# EAGLE design 5ButtonSwitch.ItsyBitsyM0.Rev1.0 (EAGLE 8.6.0)
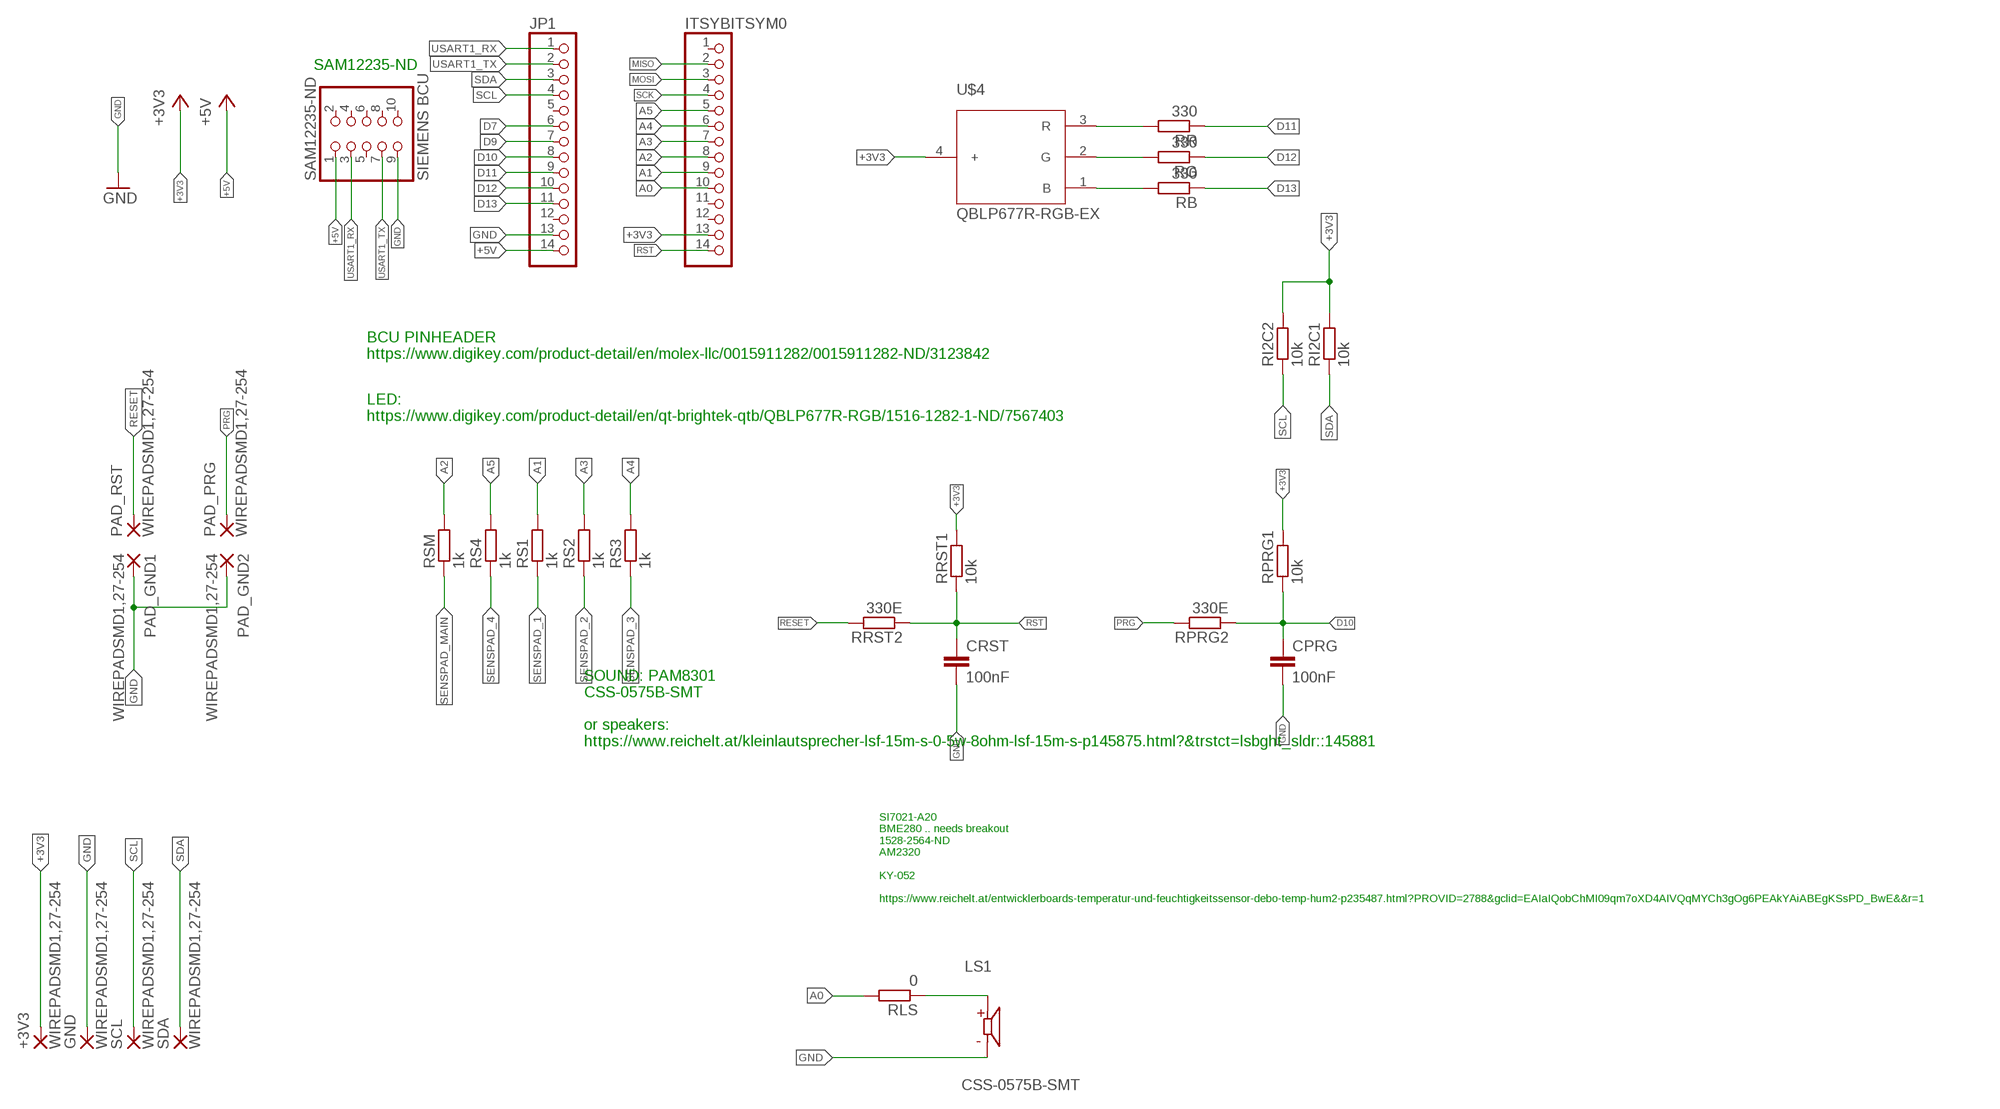
[diagram p0: schematic, sheet 1]

## Parts
+3V3  WIREPADSMD1,27-254  [SMD1,27-2,54]
CPRG  100nF  C-EUC1206  [C1206]
CRST  100nF  C-EUC1206  [C1206]
GND  WIREPADSMD1,27-254  [SMD1,27-2,54]
ITSYBITSYM0  PINHD-1X141X14_SMT  [1X14_SMT]
JP1  PINHD-1X141X14_SMT  [1X14_SMT]
LS1  CSS-0575B-SMT  [CUI_CSS-0575B-SMT]
PAD_GND1  WIREPADSMD1,27-254  [SMD1,27-2,54]
PAD_GND2  WIREPADSMD1,27-254  [SMD1,27-2,54]
PAD_PRG  WIREPADSMD1,27-254  [SMD1,27-2,54]
PAD_RST  WIREPADSMD1,27-254  [SMD1,27-2,54]
RB  330  R-EU_R1206  [R1206]
RG  330  R-EU_R1206  [R1206]
RI2C1  10k  R-EU_R1206  [R1206]
RI2C2  10k  R-EU_R1206  [R1206]
RLS  0  R-EU_R1206  [R1206]
RPRG1  10k  R-EU_R1206  [R1206]
RPRG2  330E  R-EU_R1206  [R1206]
RR  330  R-EU_R1206  [R1206]
RRST1  10k  R-EU_R1206  [R1206]
RRST2  330E  R-EU_R1206  [R1206]
RS1  1k  R-EU_R1206  [R1206]
RS2  1k  R-EU_R1206  [R1206]
RS3  1k  R-EU_R1206  [R1206]
RS4  1k  R-EU_R1206  [R1206]
RSM  1k  R-EU_R1206  [R1206]
SAM12235-ND  SIEMENS BCU  PINHD-2X5_2.54-SMD  [2X05SMD]
SCL  WIREPADSMD1,27-254  [SMD1,27-2,54]
SDA  WIREPADSMD1,27-254  [SMD1,27-2,54]
U$4  QBLP677R-RGB-EX  [PLCC4R_EX]

## Nets
+3V3: +3V3.1(P) ITSYBITSYM0.13 RI2C1.2 RI2C2.2 RPRG1.2 RRST1.2 U$4.4(+)
+5V: JP1.14 SAM12235-ND.1
A0: ITSYBITSYM0.10 RLS.2
A1: ITSYBITSYM0.9 RS1.2
A2: ITSYBITSYM0.8 RSM.2
A3: ITSYBITSYM0.7 RS2.2
A4: ITSYBITSYM0.6 RS3.2
A5: ITSYBITSYM0.5 RS4.2
D7: JP1.6
D9: JP1.7
D10: CPRG.1 JP1.8 RPRG1.1 RPRG2.1
D11: JP1.9 RR.1
D12: JP1.10 RG.1
D13: JP1.11 RB.1
GND: CPRG.2 CRST.2 GND.1(P) JP1.13 LS1.2(N) PAD_GND1.1(P) PAD_GND2.1(P) SAM12235-ND.9
MISO: ITSYBITSYM0.2
MOSI: ITSYBITSYM0.3
N$1: RB.2 U$4.1(B)
N$2: RG.2 U$4.2(G)
N$3: RR.2 U$4.3(R)
N$4: LS1.1(P) RLS.1
PRG: PAD_PRG.1(P) RPRG2.2
RESET: PAD_RST.1(P) RRST2.2
RST: CRST.1 ITSYBITSYM0.14 RRST1.1 RRST2.1
SCK: ITSYBITSYM0.4
SCL: JP1.4 RI2C2.1 SCL.1(P)
SDA: JP1.3 RI2C1.1 SDA.1(P)
SENSPAD_1: RS1.1
SENSPAD_2: RS2.1
SENSPAD_3: RS3.1
SENSPAD_4: RS4.1
SENSPAD_MAIN: RSM.1
USART1_RX: JP1.1 SAM12235-ND.3
USART1_TX: JP1.2 SAM12235-ND.7
Unconnected: ITSYBITSYM0.1 ITSYBITSYM0.11 ITSYBITSYM0.12 JP1.5 JP1.12 SAM12235-ND.2 SAM12235-ND.4 SAM12235-ND.5 SAM12235-ND.6 SAM12235-ND.8 SAM12235-ND.10

## Notes on the sheet
- SAM12235-ND
- BCU PINHEADER
  https://www.digikey.com/product-detail/en/molex-llc/0015911282/0015911282-ND/3123842
- LED:
  https://www.digikey.com/product-detail/en/qt-brightek-qtb/QBLP677R-RGB/1516-1282-1-ND/7567403
- SOUND: PAM8301
  CSS-0575B-SMT
  
  or speakers:
  https://www.reichelt.at/kleinlautsprecher-lsf-15m-s-0-5w-8ohm-lsf-15m-s-p145875.html?&trstct=lsbght_sldr::145881
- SI7021-A20
  BME280 .. needs breakout
  1528-2564-ND
  AM2320
  
  KY-052
  
  https://www.reichelt.at/entwicklerboards-temperatur-und-feuchtigkeitssensor-debo-temp-hum2-p235487.html?PROVID=2788&gclid=EAIaIQobChMI09qm7oXD4AIVQqMYCh3gOg6PEAkYAiABEgKSsPD_BwE&&r=1

## Library data of the parts
+3V3 GND PAD_GND1 PAD_GND2 PAD_PRG PAD_RST SCL SDA = wirepad:WIREPAD: Wire PAD connect wire on PCB
CPRG CRST = rcl:C-EU: CAPACITOR, European symbol; SPICEPREFIX: C
ITSYBITSYM0 JP1 = pinhead+:PINHD-1X14: PIN HEADER
LS1 = CSS-0575B-SMT:CSS-0575B-SMT: 5 mm, 3 V, 75 dB, Surface Mount (SMT), Magnetic Audio Transducer Buzzer; CUI_PURCHASE_URL: https://www.cui.com/product/audio/buzzers/audio-transducers/css-0575b-smt?utm_source=snapeda.com&utm_medium=referral&utm_campaign=snapedaBOM; DESCRIPTION: AUDIO MAGNETIC XDCR 2-4V SMD; DIGI-KEY_PART_NUMBER: 102-2202-1-ND; DIGI-KEY_PURCHASE_URL: https://www.digikey.com/product-detail/en/cui-inc/CSS-0575B-SMT-TR/102-2202-1-ND/2364651?utm_source=snapeda&utm_medium=aggregator&utm_campaign=symbol; MF: CUI Inc.; MP: CSS-0575B-SMT-TR; PACKAGE: CUI Inc.
RB RG RI2C1 RI2C2 RLS RPRG1 RPRG2 RR RRST1 RRST2 RS1-RS4 RSM = resistor:R-EU_: RESISTOR, European symbol
SAM12235-ND = pinhead:PINHD-2X5: PIN HEADER
U$4 = ChriD_TouchSwitch:QBLP677R-RGB-EX

## Board
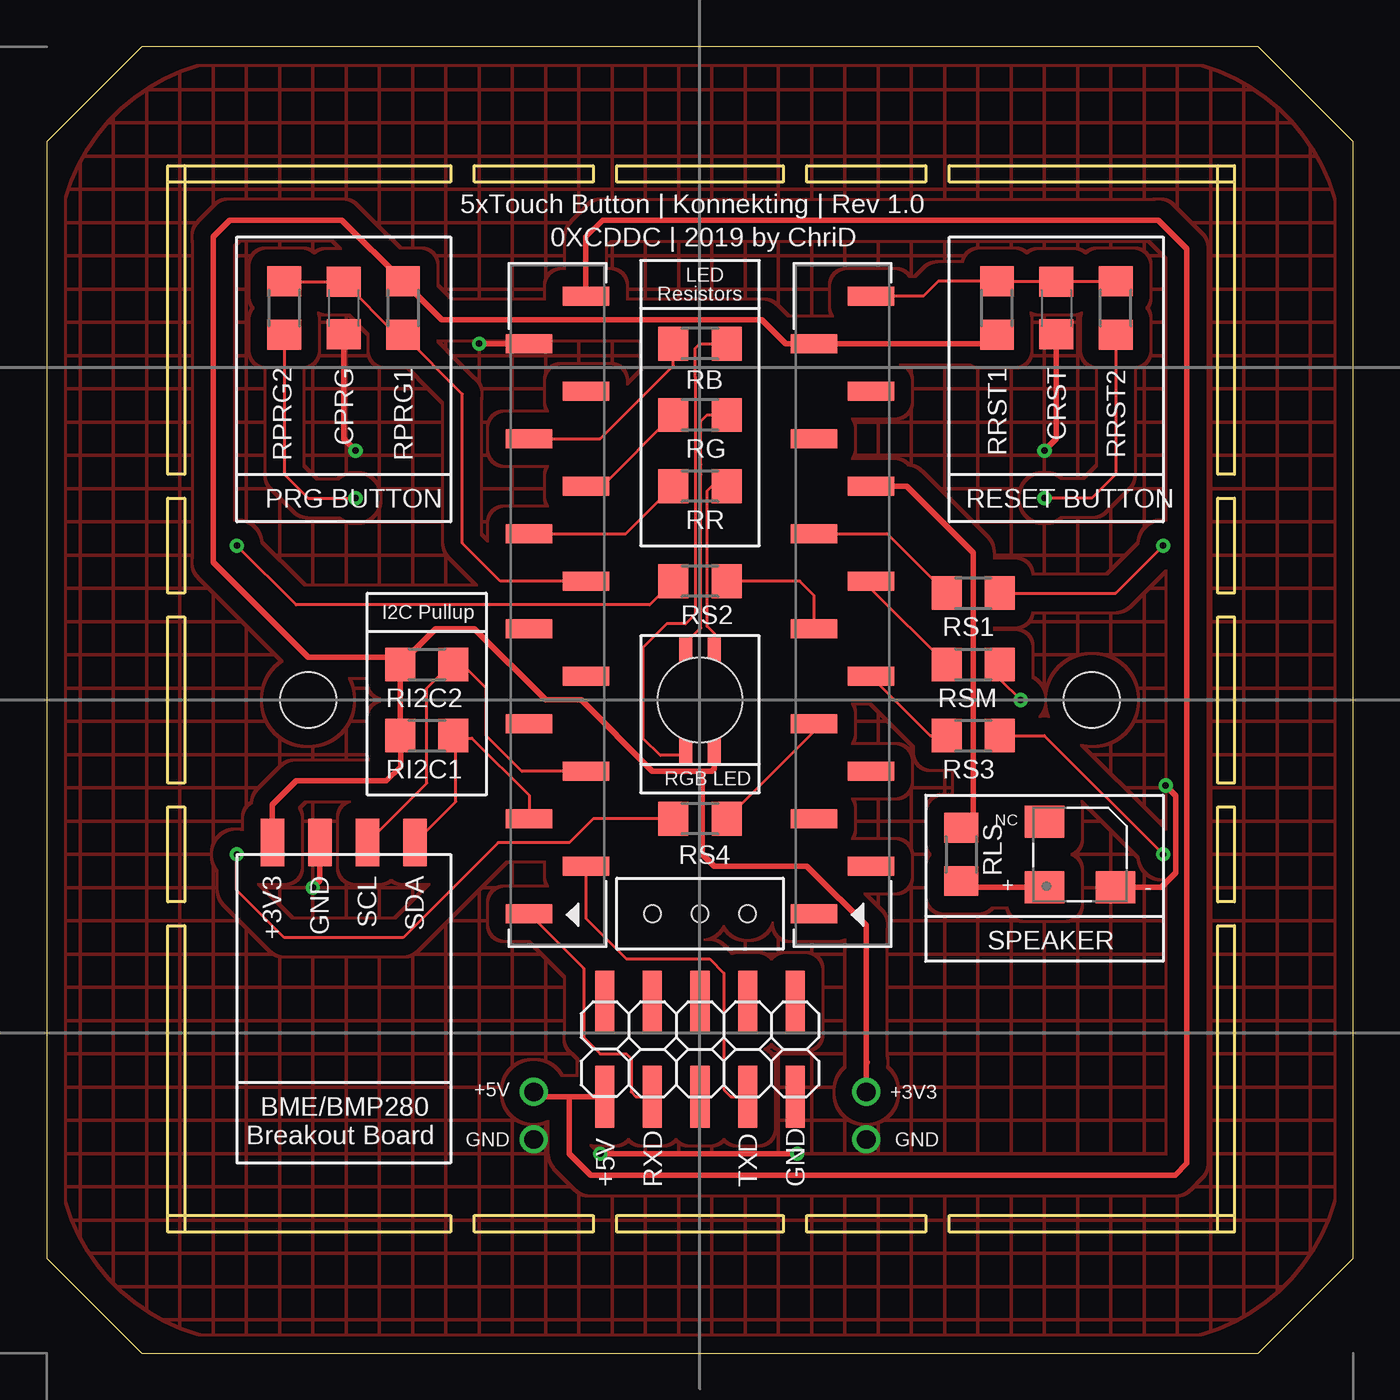
[diagram p1: board, top side]
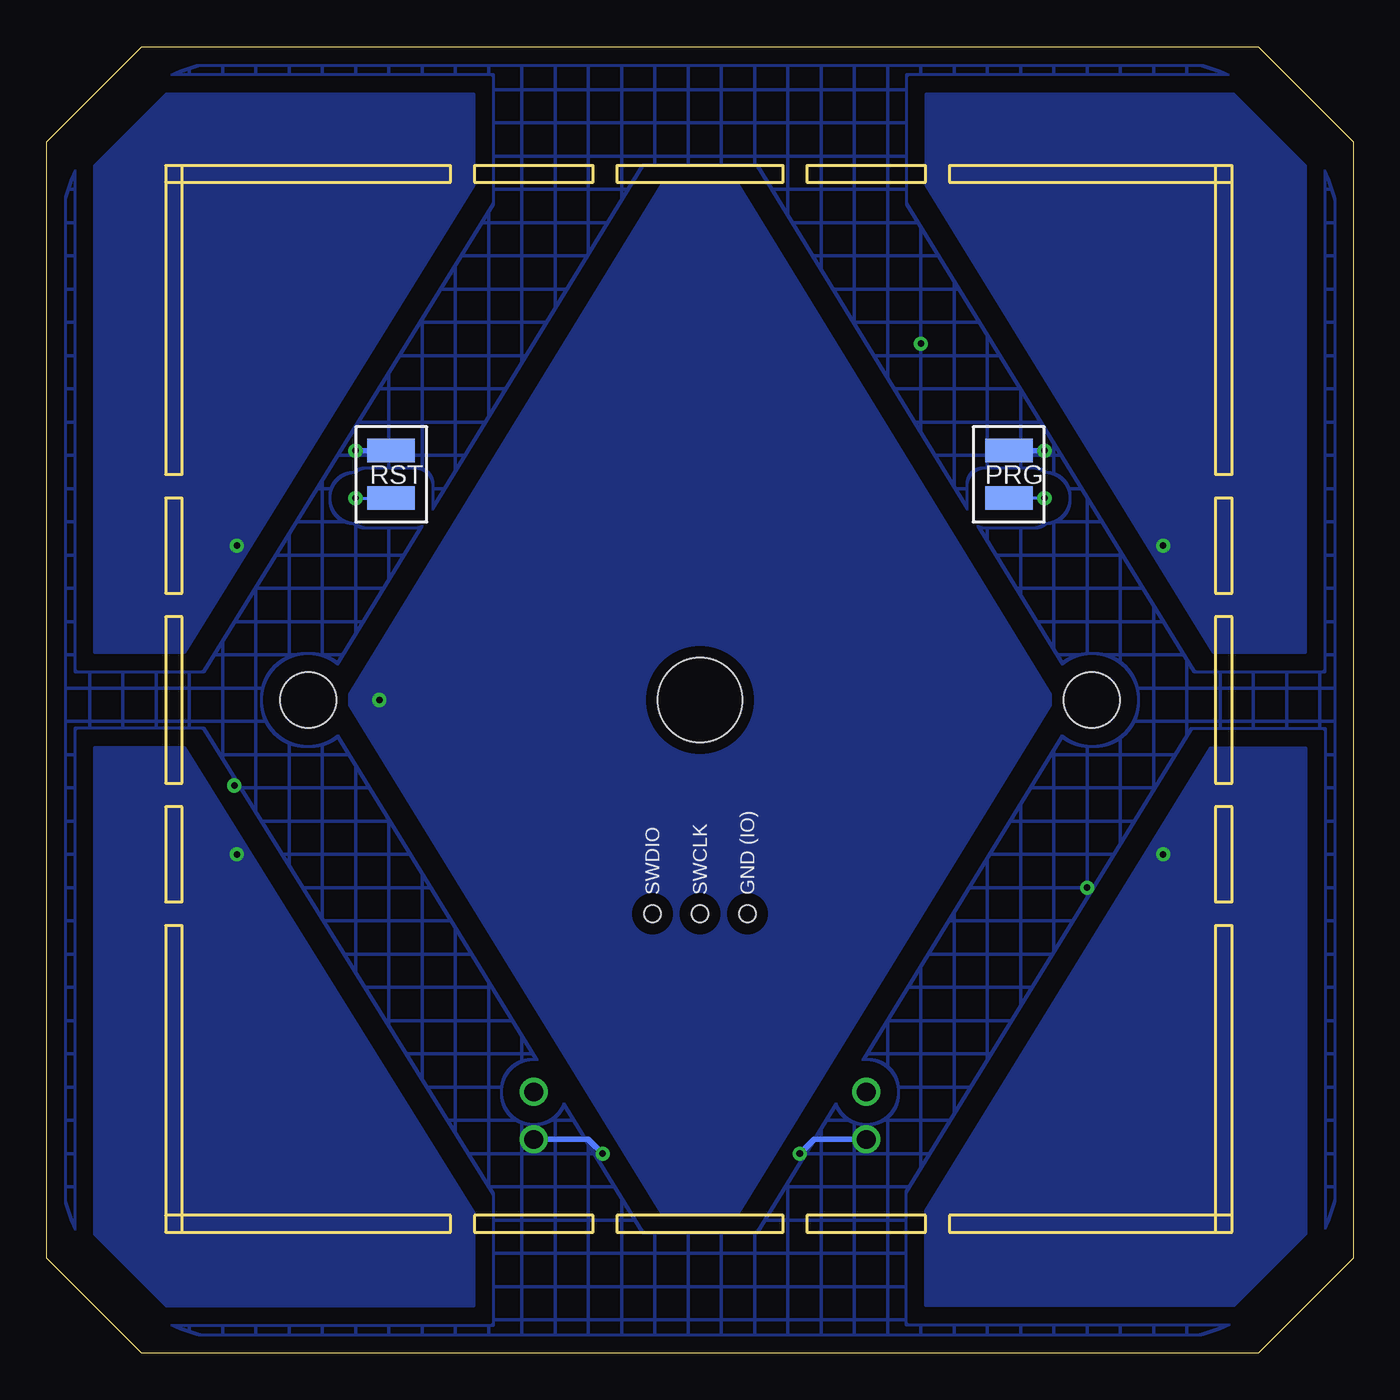
[diagram p2: board, bottom side, seen from below]

Size 69.85 x 69.85 mm. Coordinates in mm from the lower left corner, seen from the top.
Outline: 5.08,69.85 64.77,69.85 69.85,64.77 69.85,5.08 64.77,0 5.08,0 0,5.08 0,64.77 5.08,69.85
Outline: 6.34,69.84 5.08,69.85
Copper layers (1*16): Top 0.035mm / dielectric 1.5mm / Bottom 0.035mm
Design rules "konnektduino": minimum track width 6mil, minimum drill 0.35mm, track to track 6mil, track to pad 6mil, pad to pad 6mil, via to via 6mil, smd to smd 6mil, copper to edge 25mil, drill to drill 6mil, minimum pad ring 10mil, minimum via ring 8mil, stop-mask expansion 1mil, vias tented up to drill 25mil, thermal gap 10mil
Holes 0.9 mm at 37.47,23.5 34.92,23.5 32.38,23.5
Holes 3 mm at 13.97,34.92 55.88,34.92
Milling: 80 lines

### Footprints (pad centres in the part's own frame; a part is rotated, then mirrored left to right if it is on the bottom)
SMD1,27-2,54 = smd 1.27 x 2.54: 1 0,0
C1206 = smd 1.6 x 1.8: 1 -1.4,0; 2 1.4,0
1X14_SMT = smd 1 x 2.5: 1 -16.51,1.52; 2 -13.97,-1.52; 3 -11.43,1.52; 4 -8.89,-1.52; 5 -6.35,1.52; 6 -3.81,-1.52; 7 -1.27,1.52; 8 1.27,-1.52; 9 3.81,1.52; 10 6.35,-1.52; 11 8.89,1.52; 12 11.43,-1.52; 13 13.97,1.52; 14 16.51,-1.52
CUI_CSS-0575B-SMT = smd 2.1 x 1.7: 1 -1.9,-1.75; 2 1.9,-1.75; 3 -1.9,1.75
R1206 = smd 1.6 x 1.803: 1 -1.422,0; 2 1.422,0
2X05SMD = smd 1.016 x 3.302: 1 -1.27,-3.81; 2 -1.27,1.27; 3 1.27,-3.81; 4 1.27,1.27; 5 3.81,-3.81; 6 3.81,1.27; 7 6.35,-3.81; 8 6.35,1.27; 9 8.89,-3.81; 10 8.89,1.27
PLCC4R_EX = smd 1.4 x 0.7: 1 -2.667,0.762; 2 2.64,0.762; 3 2.64,-0.762; 4 -2.667,-0.762 | hole 4.5: 0,0

### Placement (x,y rotation side)
+3V3  12.06,27.3 0 top
CPRG  15.88,55.88 270 top
CRST  53.98,55.88 270 top
GND  14.61,27.3 0 top
ITSYBITSYM0  42.55,40.01 90 top
JP1  27.3,40.01 90 top
LS1  55.24,26.67 0 top
PAD_GND1  18.41,48.26 90 bottom
PAD_GND2  51.44,48.26 90 bottom
PAD_PRG  18.41,45.72 90 bottom
PAD_RST  51.44,45.72 90 bottom
RB  34.92,53.98 0 top
RG  34.92,50.16 0 top
RI2C1  20.32,33.02 180 top
RI2C2  20.32,36.83 180 top
RLS  48.9,26.67 90 top
RPRG1  19.05,55.88 90 top
RPRG2  12.7,55.88 270 top
RR  34.92,46.35 0 top
RRST1  50.8,55.88 270 top
RRST2  57.15,55.88 270 top
RS1  49.53,40.64 180 top
RS2  34.92,41.27 0 top
RS3  49.53,33.02 180 top
RS4  34.92,28.57 0 top
RSM  49.53,36.83 180 top
SAM12235-ND  31.11,17.53 0 top
SCL  17.14,27.3 0 top
SDA  19.68,27.3 0 top
U$4  34.92,34.92 90 top

### Tracks (layer width: path | path; a pad name or v marks a point on that pad's centre or on a via)
+3V3  (via drill 1)
  Top 0.305: RRST1.2 50.32,53.98 ITSYBITSYM0.13 39.5,53.98 38.23,55.24 21.11,55.24 RPRG1.2 15.77,60.58 9.78,60.58 8.89,59.69 8.89,42.29 13.97,37.21 14.92,37.21 18.26,37.21 18.9,36.58 | 18.9,36.58 RI2C2.2 20.8,38.73 22.86,38.73 26.67,34.92 28.57,34.92 32.38,31.11 35.05,31.11 | 18.9,36.58 RI2C1.2 18.92,32.99 18.92,31.37 18.16,30.61 13.34,30.61 12.06,29.34 +3V3.1 | U$4.4 35.69,31.24 35.56,31.11 35.05,31.11 | v43.81,13.97 43.81,15.49 | 43.81,15.49 43.81,22.89 42.4,24.3 42.38,24.3 40.64,26.04 35.69,26.04 35.05,26.67 35.05,31.11 | 43.87,15.54 43.81,15.49
+5V  (via drill 1)
  Top 0.305: JP1.14 28.82,59.69 29.72,60.58 59.44,60.58 60.96,59.05 60.96,10.16 60.33,9.53 29.08,9.53 27.94,10.67 27.94,13.72 | 29.59,13.97 SAM12235-ND.1 27.94,13.72 | 27.94,13.72 26.29,13.72 v26.04,13.97
A0
  Top 0.305: ITSYBITSYM0.10 45.97,46.35 49.53,42.8 49.53,28.73 RLS.2
A1
  Top 0.152: ITSYBITSYM0.9 44.93,43.81 RS1.2
A2
  Top 0.152: ITSYBITSYM0.8 44.06,40.87 RSM.2
A3
  Top 0.152: ITSYBITSYM0.7 41.02,40.51 40.26,41.27 RS2.2
A4
  Top 0.152: ITSYBITSYM0.6 47.24,33.02 RS3.2
A5
  Top 0.152: RS4.2 41.02,33.25 ITSYBITSYM0.5
D10
  Top 0.152: RPRG2.1 12.72,57.28 CPRG.1 18.7,54.46 RPRG1.1 22.23,51.28 22.23,43.31 24.26,41.27 JP1.8
D11
  Top 0.152: JP1.9 30.96,43.81 RR.1
D12
  Top 0.152: JP1.10 29.69,46.35 RG.1
D13
  Top 0.152: JP1.11 29.59,48.9 33.5,52.81 RB.1
GND  (via drill 0.35, 1)
  Top 0.305: GND.1 14.61,25.27 v14.22,24.89 | CPRG.2 15.88,48.9 v16.51,48.26 | CRST.2 53.98,48.9 v53.34,48.26 | JP1.13 v23.11,53.98 | v29.59,10.67 v40.13,10.67 | LS1.2 59.59,24.92 60.37,25.7 60.37,29.8 v59.82,30.35
  Bottom 0.305: v16.51,48.26 PAD_GND1.1 | v53.34,48.26 PAD_GND2.1 | v26.04,11.43 28.83,11.43 v29.59,10.67 | v40.13,10.67 40.89,11.43 v43.81,11.43
  pour Top (isolate 0.889, rank 6, no thermals, hatched): 0.64,10.79 arc90 10.79,0.64 59.05,0.64 arc90 69.22,10.79 69.22,59.05 arc90 59.05,69.22 10.79,69.22 arc90 0.64,59.05
  pour Bottom (isolate 0.889, rank 6, no thermals, hatched): 0.64,10.79 arc90 10.79,0.64 59.05,0.64 arc90 69.22,10.79 69.22,59.05 arc90 59.05,69.22 10.79,69.22 arc90 0.64,59.05
N$1
  Top 0.152: U$4.1 34.16,31.96 32.81,31.96 31.88,32.89 31.88,37.72 33.15,38.99 34.16,38.99 34.67,39.5 34.67,52.07 34.67,52.2 34.67,53.72 34.92,53.98 RB.2
N$2
  Top 0.152: U$4.2 34.16,37.97 34.98,38.79 34.98,46.99 34.98,47.52 34.98,49.84 35.31,50.16 RG.2
N$3
  Top 0.152: U$4.3 35.69,38.48 35.31,38.86 35.31,46.1 35.56,46.35 RR.2
N$4
  Top 0.305: LS1.1 49.22,24.92 RLS.1
PRG  (via drill 0.35)
  Top 0.152: RPRG2.2 12.7,46.99 13.97,45.72 v16.51,45.72
  Bottom 0.152: v16.51,45.72 PAD_PRG.1
RESET  (via drill 0.35)
  Top 0.152: RRST2.2 57.15,46.99 55.88,45.72 v53.34,45.72
  Bottom 0.152: v53.34,45.72 PAD_RST.1
RST
  Top 0.152: RRST2.1 57.13,57.28 CRST.1 50.82,57.28 RRST1.1 47.65,57.3 46.86,56.52 ITSYBITSYM0.14
SCL
  Top 0.152: JP1.4 25.4,31.11 23.5,33.02 23.5,35.56 22.23,36.83 RI2C2.1 21.59,36.83 20.32,35.56 20.32,30.48 SCL.1
SDA
  Top 0.152: RI2C1.1 21.87,32.89 | 21.87,32.89 22.73,32.89 25.79,29.84 JP1.3 | SDA.1 21.87,29.49 21.87,32.89
SENSPAD_1  (via drill 0.35)
  Top 0.152: RS1.1 57.15,40.64 v59.69,43.18
  pour Bottom: 46.99,62.48 46.99,67.31 63.5,67.31 67.31,63.5 67.31,37.47 62.48,37.47
SENSPAD_2  (via drill 0.35)
  Top 0.152: RS2.1 32.23,40.01 13.34,40.01 v10.16,43.18
  pour Bottom: 22.86,62.48 7.49,37.48 2.54,37.47 2.54,63.5 6.35,67.31 22.86,67.31 22.86,64.77
SENSPAD_3  (via drill 0.35)
  Top 0.152: RS3.1 53.34,33.02 v59.69,26.67
  pour Bottom: 46.99,7.49 62.48,32.38 67.31,32.38 67.31,6.35 63.5,2.54 46.99,2.54
SENSPAD_4  (via drill 0.35)
  Top 0.152: RS4.1 29.21,28.57 27.94,27.3 24.13,27.3 19.05,22.23 12.7,22.23 10.16,24.77 v10.16,26.67
  pour Bottom: 22.86,7.62 7.62,32.38 2.54,32.38 2.54,6.35 6.35,2.54 22.86,2.54
SENSPAD_MAIN  (via drill 0.35)
  Top 0.152: RSM.1 50.95,36.04 v52.07,34.92
  pour Bottom: 36.96,62.48 53.85,34.92 36.96,7.49 32.89,7.49 16,34.92 32.89,62.48
USART1_RX
  Top 0.152: JP1.1 28.7,20.58 28.7,16.89 29.59,16 30.99,16 31.24,15.75 31.24,13.97 31.5,13.72 SAM12235-ND.3
USART1_TX
  Top 0.152: JP1.2 28.82,23.25 30.99,21.08 35.43,21.08 36.2,20.32 36.2,20.07 36.2,14.1 36.58,13.72 SAM12235-ND.7

### Text on the board
tPlace: SPEAKER | BME/BMP280 | Breakout Board
tNames: 5xTouch Button | Konnekting | Rev 1.0 | 0XCDDC | 2019 by ChriD | LED | Resistors | PRG BUTTON | RESET BUTTON | I2C Pullup | RGB LED | +5V | +3V3 | GND | GND | +5V | RXD | TXD | GND
bNames: PRG | RST | GND (IO) | SWCLK | SWDIO